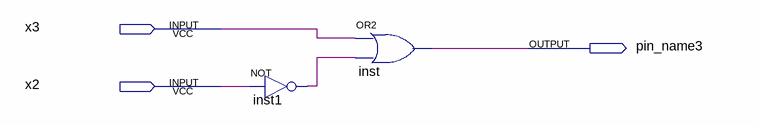
[diagram p0: schematic sheet]
// Quartus schematic number.bdf as structural Verilog: 2 symbols, 3 pins
module number (
  input  x3,
  input  x2,
  output pin_name3
);

  wire inst1_out;

  not inst1 (inst1_out, x2);
  or inst (pin_name3, x3, inst1_out);
endmodule
